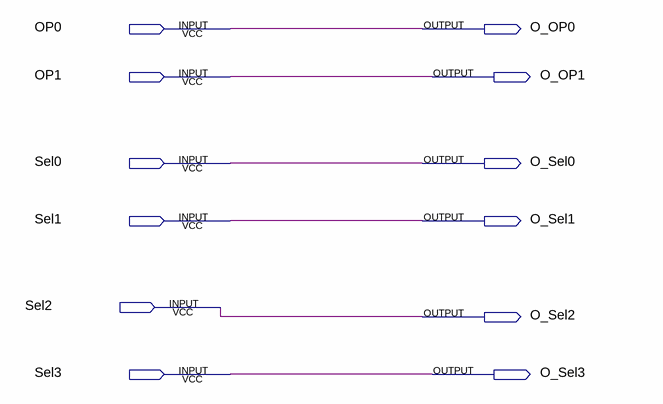
[diagram p0: schematic sheet]
// Quartus schematic Decoder.bdf as structural Verilog: 0 symbols, 12 pins
module Decoder (
  input  OP0,
  input  OP1,
  input  Sel0,
  input  Sel1,
  input  Sel2,
  input  Sel3,
  output O_OP0,
  output O_OP1,
  output O_Sel0,
  output O_Sel1,
  output O_Sel2,
  output O_Sel3
);


  assign O_OP0 = OP0;
  assign O_OP1 = OP1;
  assign O_Sel0 = Sel0;
  assign O_Sel1 = Sel1;
  assign O_Sel2 = Sel2;
  assign O_Sel3 = Sel3;
endmodule
